# Altium schematic sheet RPI 3 Backpower.SchDoc
size A4
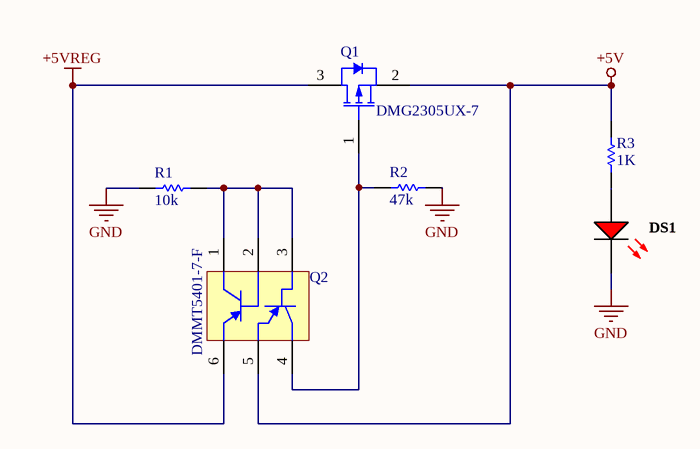
[diagram p0: RPI 3 Backpower.SchDoc]

## Parts
DS1  APG1608SURKC/T  [KING-LED0603-25-RED_V]  (value not drawn)
Q1  DMG2305UX-7  [DIOD-SOT23-3_A_V]
Q2  DMMT5401-7-F  [DIOD-SOT-26-6_N]
R1  10k  [RESC1609X55X30LL15T15]
R2  47k  [RESC1608X55X25LL10T15]
R3  1K  [RESC1608X55X30LL15T15]

## Nets
+5V: Q1.2(SOURCE) Q2.5(E2) R3.2
+5VREG: Q1.3(DRAIN) Q2.6(E1)
GND: DS1.2(K) R1.1 R2.1
NetDS1_1: DS1.1(A) R3.1
NetQ1_1: Q1.1(GATE) Q2.4(C2) R2.2
NetQ2_1: Q2.1(C1) Q2.2(B1) Q2.3(B2) R1.2

## Library data of the parts
DS1 = CMP-0404-00004-1: Ultra Thin Hyper Red SMD Chip LED Lamp, 2 to 2.5 V, -40 to 85 degC, Body 1.6 x 0.8 mm, 0.28 mm Thickness, RoHS, Tape and Reel; Manufacturer: Kingbright; Dice: Hyper Red (AlGaInP); IR (Max): 10 uA; Luminous Intensity mcd @ 20 mA (Min.): 55; Lens Type: Water Clear; Viewing Angle: 120; Luminous Intensity mcd @ 20 mA (Typ.): 110; ComponentLink2Description: Datasheet; ComponentLink3URL: http://www.kingbrightusa.com/images/catalog/SPEC/APG1608SURKC-T.pdf; Packing: Tape and Reel; Mounting Technology: Surface Mount; PackageVersion: Rev. V.5A; ComponentLink1Description: Manufacturer URL; ComponentLink2URL: http://www.kingbrightusa.com/images/catalog/SPEC/APG1608SURKC-T.pdf; ComponentLink3Description: Package Specification; PackageDescription: 2-Pin SMT, Body 1.6 x 0.8 mm, 0.28mm Thickness, Red; PackageReference: LED0603-25-RED; DatasheetVersion: Rev. V.5A; Operating Temperature: -40 to 85 degC; PartNumber: APG1608SURKC/T; ComponentLink1URL: http://www.kingbrightusa.com/; Forward Voltage: 2 to 2.5 V; RoHS: TRUE
Q1 = CMP-1693-00002-3: P-Channel Enhancement Mode MOSFET, 20 V, -55 to 150 degC, 3-Pin SOT23, RoHS, Tape and Reel; RoHSCompliant: True; Pins: 3; PackageDescription: 3-Pin Small Outline Transistor, Body 2.9 x 1.3 mm, Pitch 0.915 mm; Min Operating Temperature: -55 degC; Mounting Technology: Surface Mount; ComponentLink2URL: http://www.diodes.com/_files/datasheets/DMG2305UX.pdf; PartNumber: DMG2305UX-7; ComponentLink1URL: http://www.diodes.com/; DatasheetVersion: Rev. 5-2; Max Operating Temperature: 150 degC; Packaging: Tape and Reel; Radiation Hardening: No; ComponentLink1Description: Manufacturer URL; Case/Package: TO-236-3; ComponentLink2Description: Datasheet; Package Quantity: 1; Mount: Surface Mount
Q2 = CMP-1667-00007-1: Matched PNP Small Signal Surface Mount Transistor, 300 mW, -55 to 150 degC, 6-Pin SOT-26, RoHS, Tape and Reel; Tolerance: 1%; Resistance: 56.2 kohm; Case\Package: 0603; Voltage Rating: 50 V; Power Rating: 100 mW; Width: 0.8 mm; ComponentLink2URL: http://www.diodes.com/_files/datasheets/ds30437.pdf; ComponentLink2Description: Datasheet; Min Operating Temperature: -55 degC; Max Operating Temperature: 155 degC; Height: 0.45 mm; Case Code (Metric): 1608; Package Quantity: 200; DatasheetVersion: Rev. 6-2, 05/2009; Packaging: Tape and Reel; Length: 1.6 mm; PackageDescription: 6-Pin Small Outline Transistor, Body 1.6 x 3 mm, Pitch 0.95 mm; RoHSCompliant: true; PackageReference: SOT-26-6; ComponentLink1URL: http://www.diodes.com/; Case Code (Imperial): 0603; ComponentLink1Description: Manufacturer URL
R1 = CMP-2000-07452-1: Chip Resistor, 10 KOhm, +/- 1%, 0.1 W, -55 to 155 degC, 0603 (1608 Metric), RoHS, Tape and Reel; Manufacturer: Panasonic; Voltage Rating: 75V; Case\/Package: 0603; Power Rating: 100mW; Resistance: 10KOhm; Temperature Coefficient: 100ppm\/degreesC; Number of Pins: 2; Package Reference: 603; Depth: 0.8mm; Mount: SurfaceMount; Package Description: 2-Pin Surface Mount Device, Body 1.6 x 0.85 mm; Datasheet Version: 02/2017; Length: 1.6mm; Lead Free: LeadFree; Height: 0.45mm; Number of Terminations: 2; Max Power Dissipation: 100mW; Min Operating Temperature: -55degC; Datasheet URL: https://industrial.panasonic.com/cdbs/www-data/pdf/RDA0000/AOA0000C304.pdf; Termination: SMD/SMT; Case Code (Metric): 1608; Case Code (Imperial): 0603; Tolerance: 1%; Max Operating Temperature: 155degC; RoHSCompliant: true; Voltage Rating (DC): 75V; Radiation Hardening: No; Packaging: TapeandReel; Composition: ThickFilm; Mounting Technology: SurfaceMount; Manufacturer URL: http://www.panasonic.com/; Width: 0.031inch; REACH SVHC: NoSVHC; Contact Plating: Tin; Military Standard: Not; Package Quantity: 1
R2 = CMP-2000-04844-1: Manufacturer: Yageo; Part Number: AC0603FR-0747KL
R3 = CMP-2000-00180-1: Part Number: ERJ-3EKF1001V; Manufacturer: Panasonic